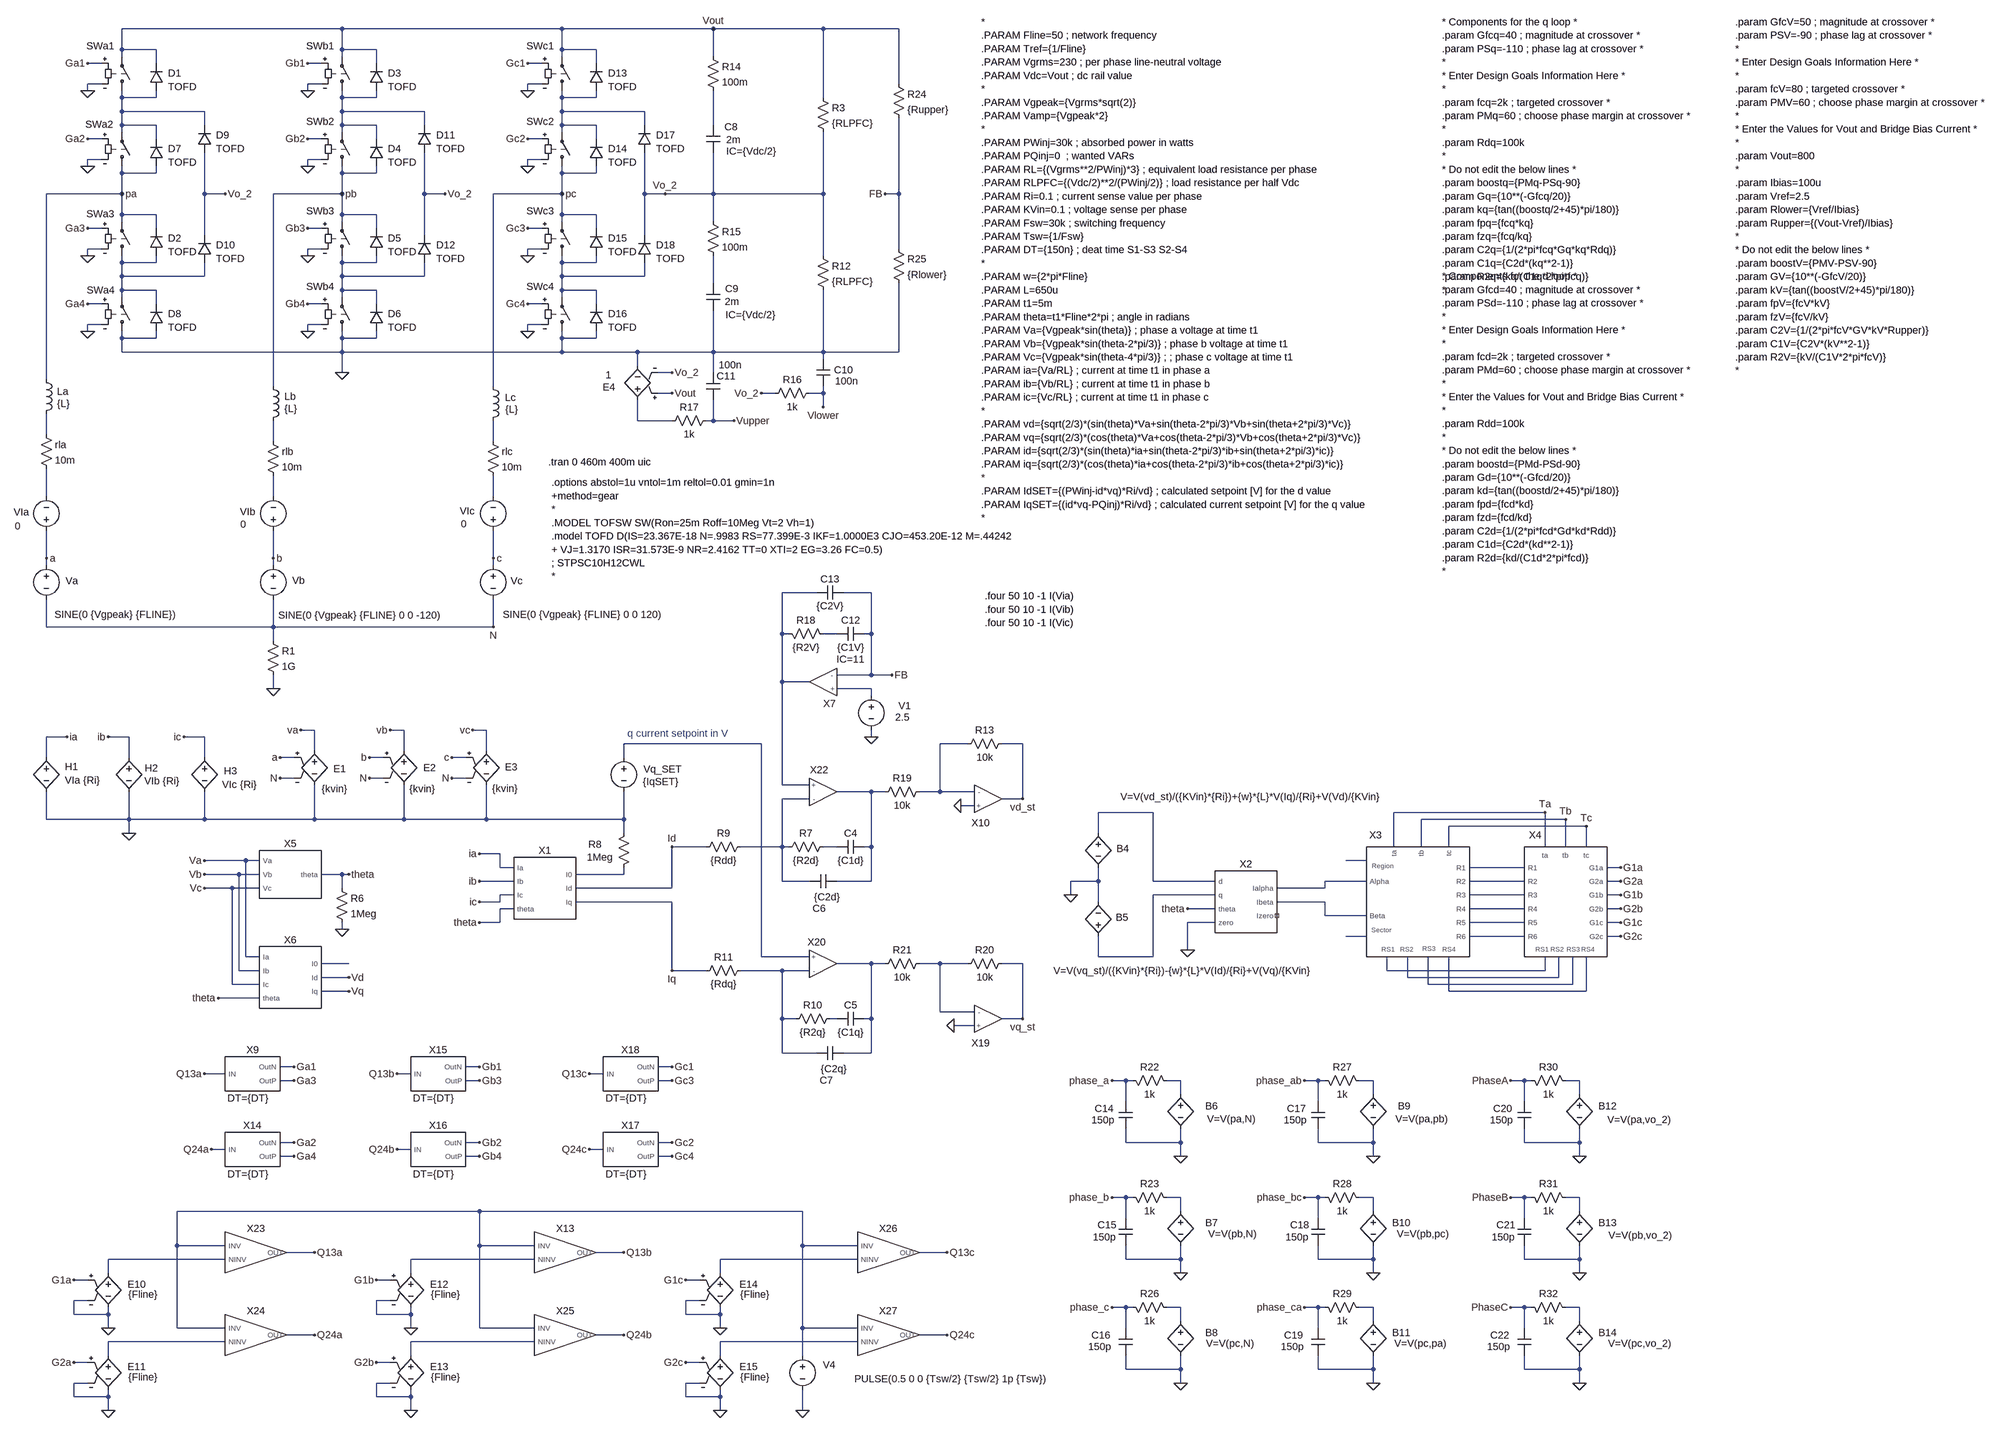
[diagram p0: schematic 3-phase NPC inverter with switches - PFC 800 V - SVM.asc]
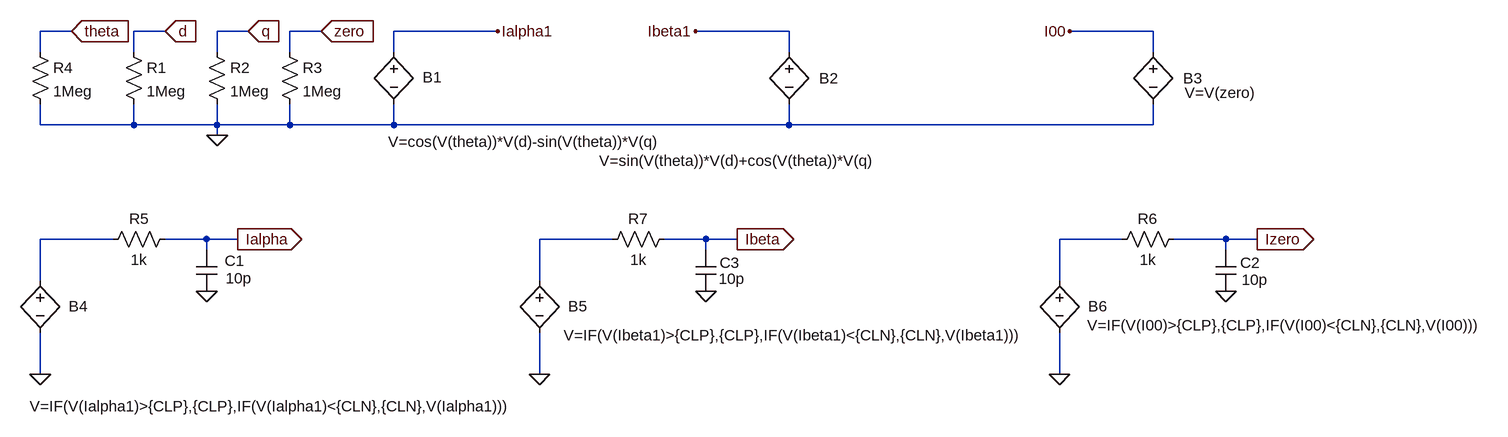
[diagram p1: sub-circuit inverse_dq_alpha_beta.asc]
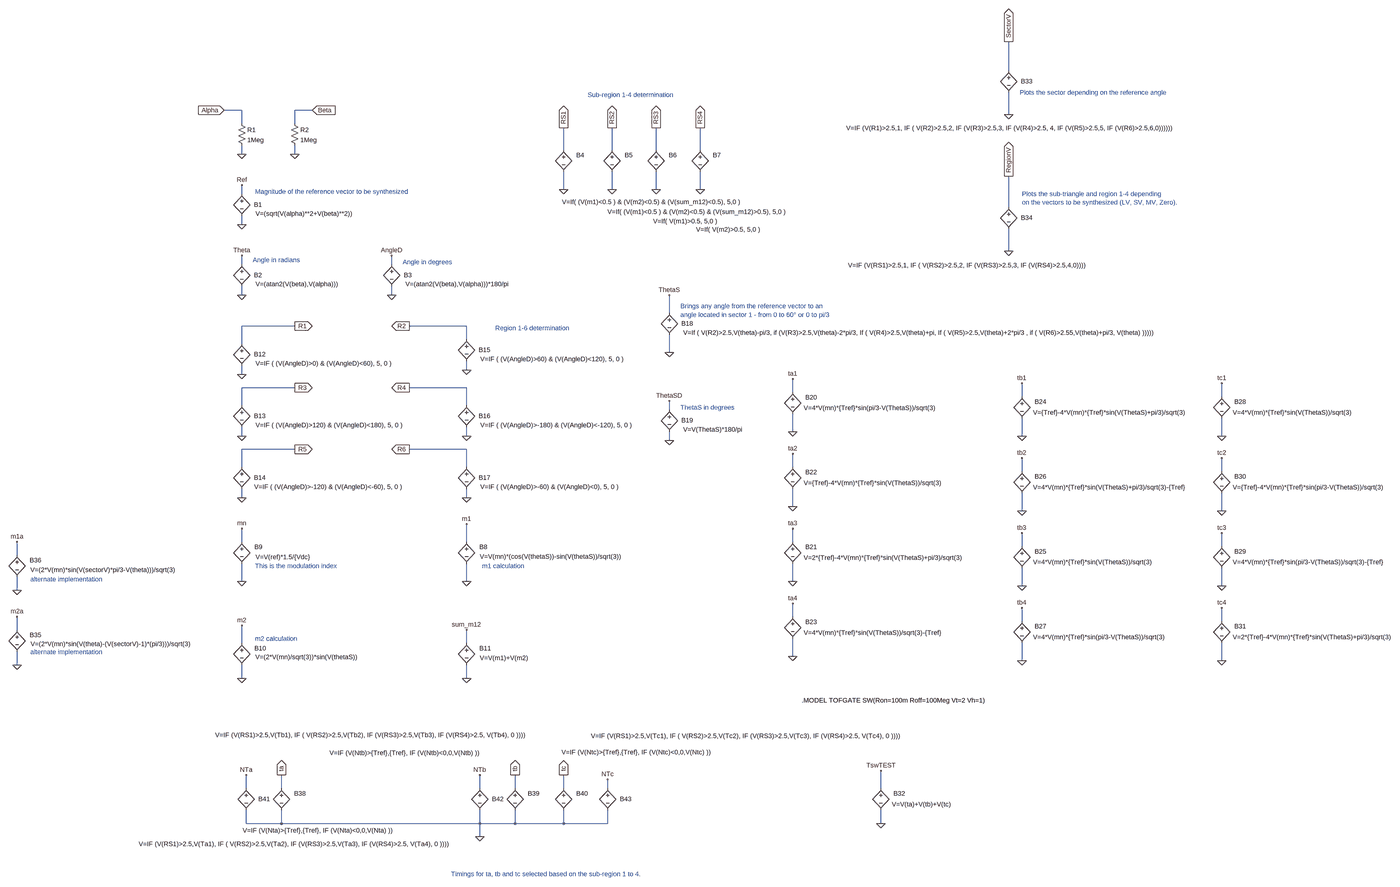
[diagram p2: sub-circuit alphabetatimings.asc, whole sheet]
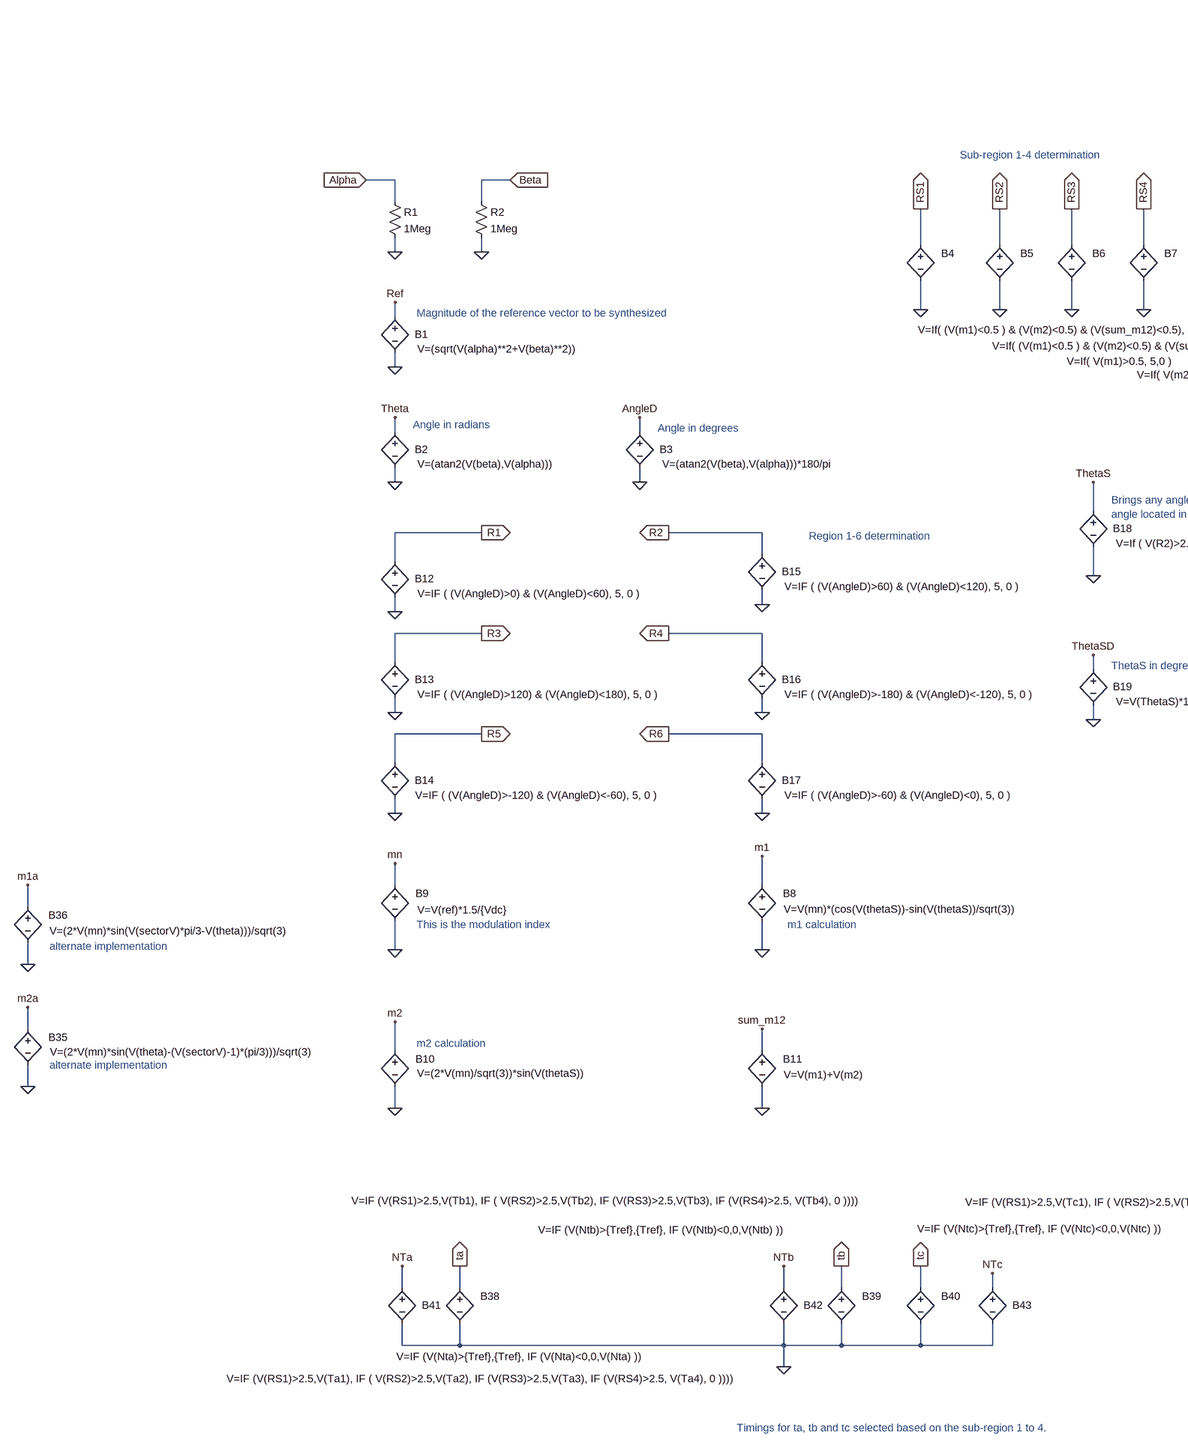
[diagram p3: sub-circuit alphabetatimings.asc, part, row 1 of 1, column 1 of 2]
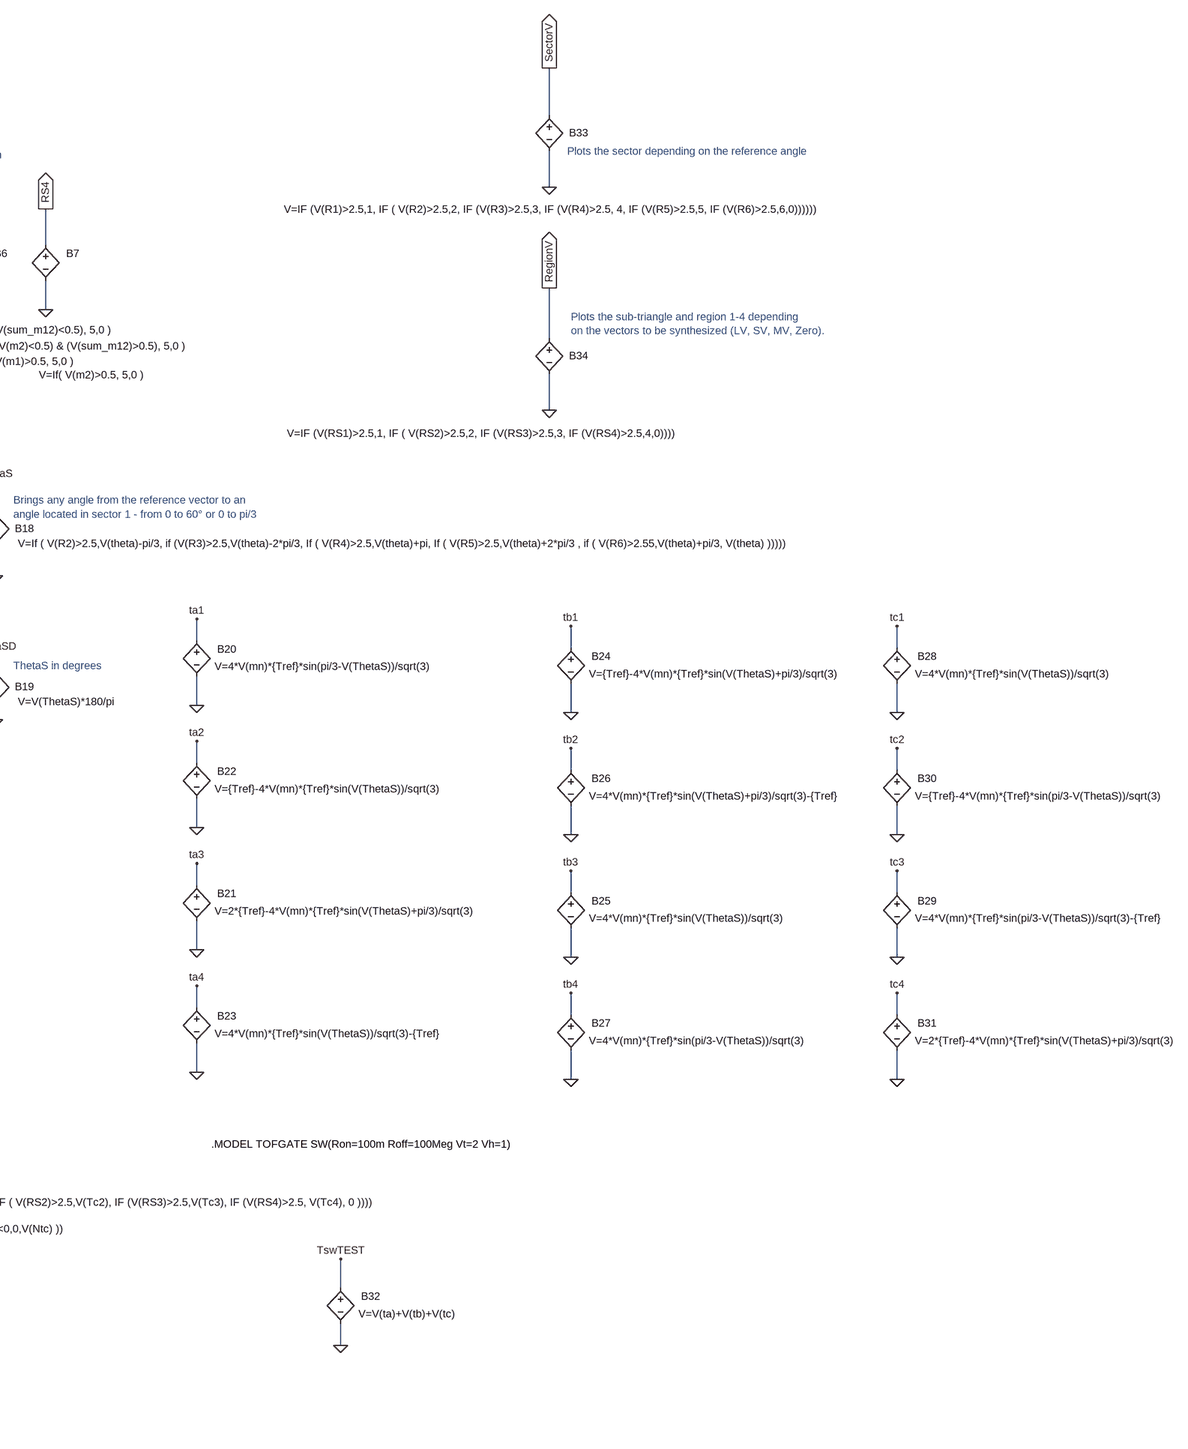
[diagram p4: sub-circuit alphabetatimings.asc, part, row 1 of 1, column 2 of 2]
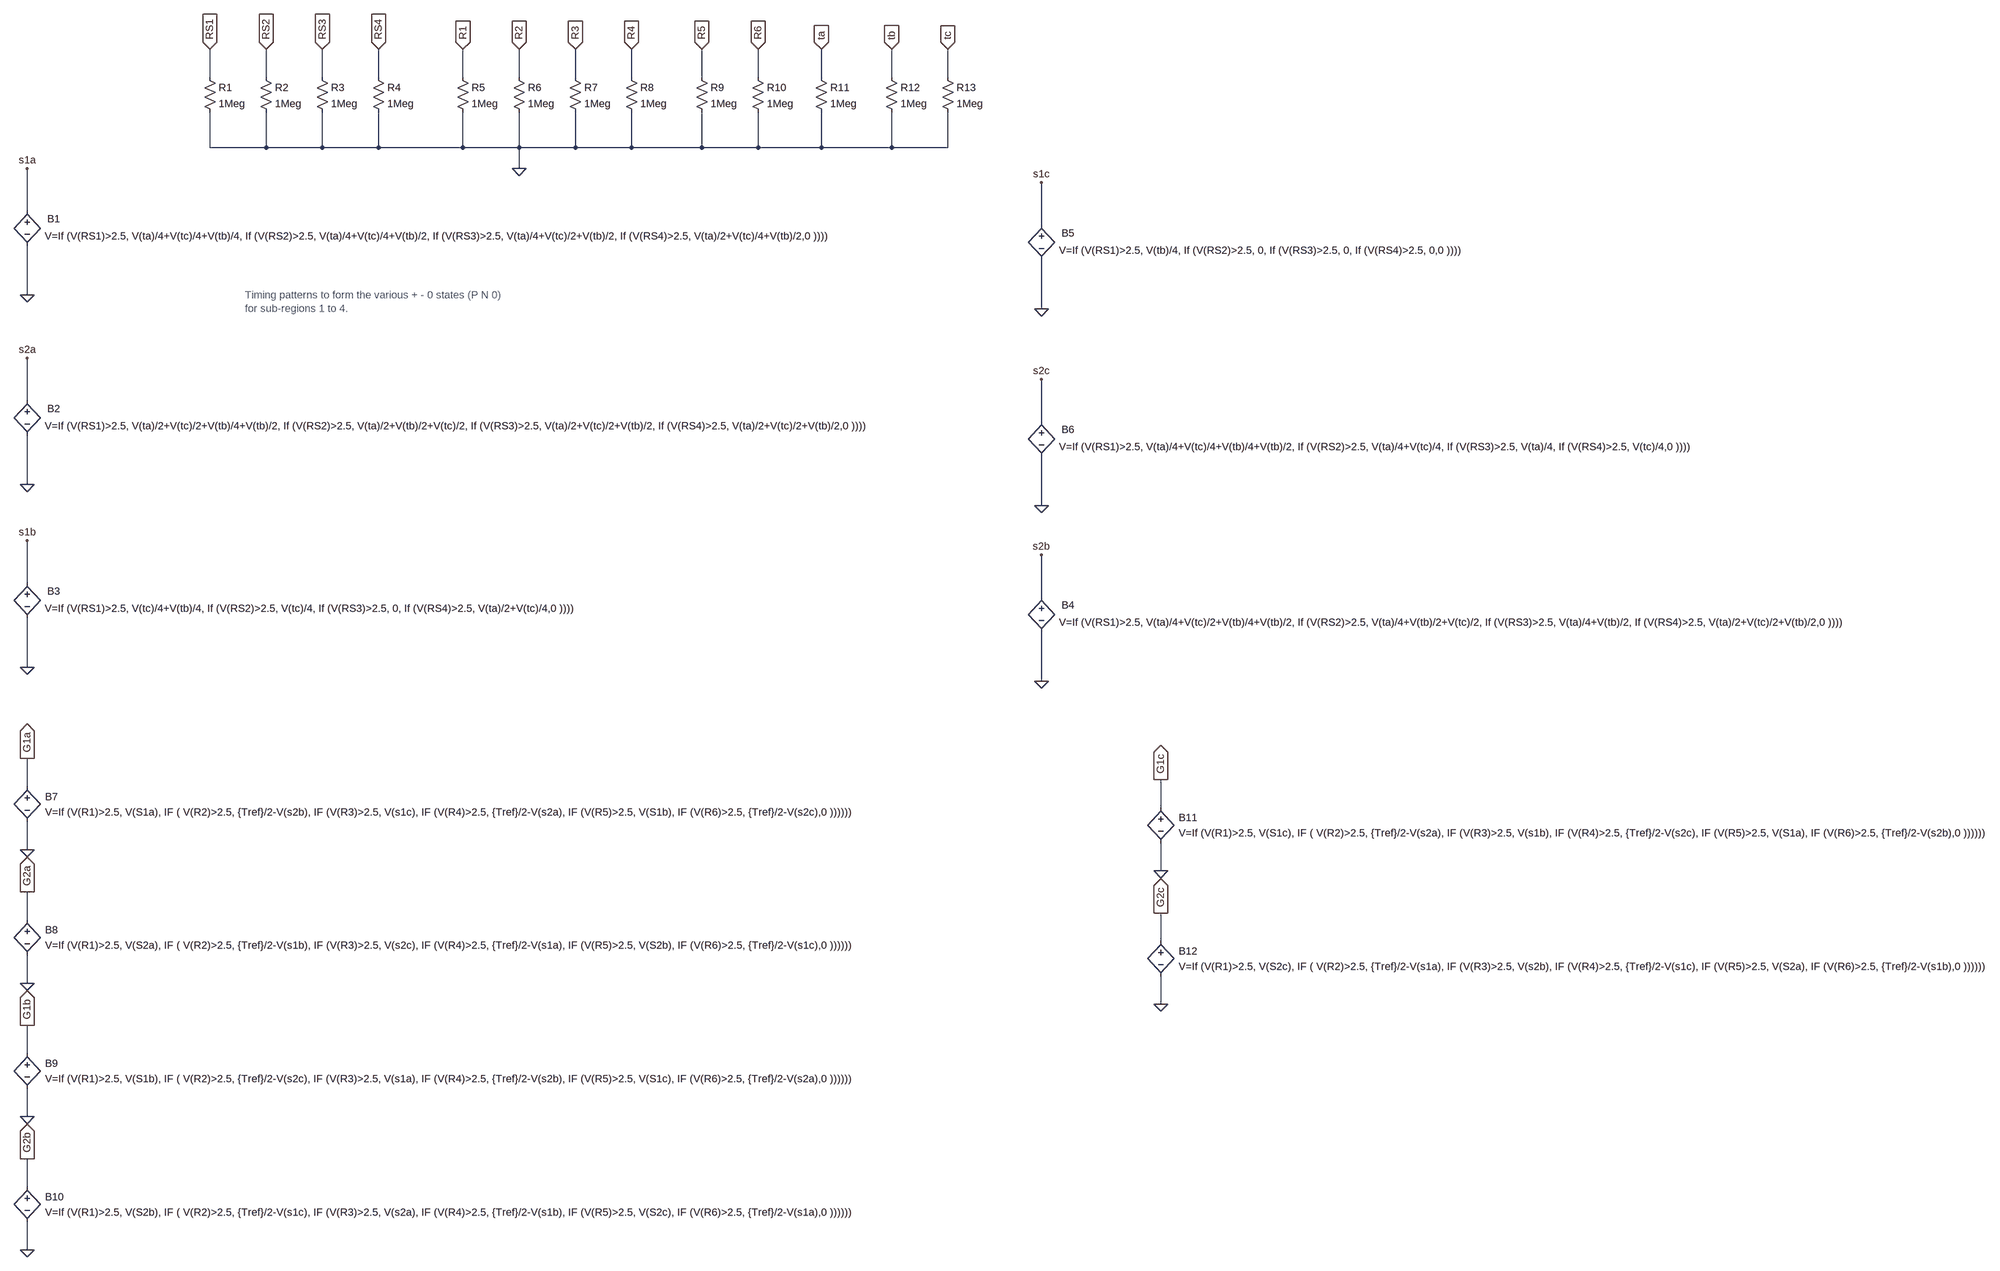
[diagram p5: sub-circuit timinggenerator.asc]
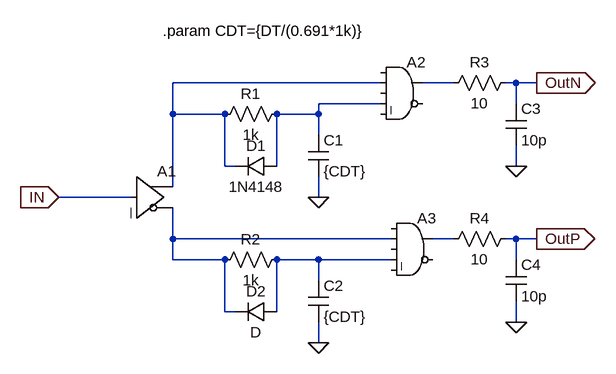
[diagram p6: sub-circuit dt_driver.asc]
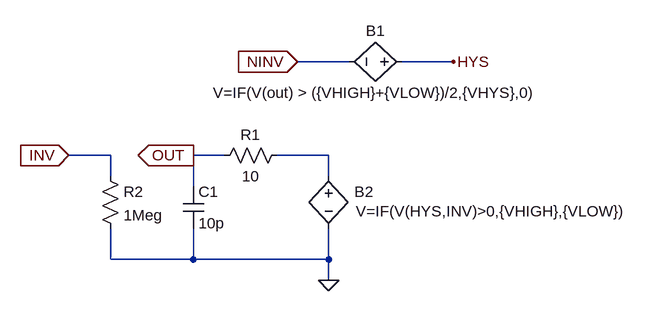
[diagram p7: sub-circuit comptof.asc]
* 3-phase NPC inverter with switches - PFC 800 V - SVM.asc
Va a N SINE(0 {Vgpeak} {FLINE})
Vb b N SINE(0 {Vgpeak} {FLINE} 0 0 -120)
Vc c N SINE(0 {Vgpeak} {FLINE} 0 0 120)
R1 N 0 1G
rla N010 N013 10m
rlb N011 N014 10m
rlc N012 N015 10m
H1 ia 0 VIa {Ri}
H2 ib 0 VIb {Ri}
H3 ic 0 VIc {Ri}
La pa N010 {L}
Lb pb N011 {L}
Lc pc N012 {L}
VIa a N013 0
VIb b N014 0
VIc c N015 0
SWa1 N001 Vout Ga1 0 TOFSW
E1 va 0 a N {kvin}
E2 vb 0 b N {kvin}
E3 vc 0 c N {kvin}
R7 N022 N024 {R2d}
C4 N024 N021 {C1d}
C6 N022 N021 {C2d}
R8 0 N027 1Meg
R9 N022 Id {Rdd}
R10 N040 N045 {R2q}
C5 N045 N038 {C1q}
C7 N040 N038 {C2q}
R11 N040 Iq {Rdq}
D1 N001 Vout TOFD
SWa2 pa N001 Ga2 0 TOFSW
D7 pa N001 TOFD
SWa3 N005 pa Ga3 0 TOFSW
D2 N005 pa TOFD
SWa4 0 N005 Ga4 0 TOFSW
D8 0 N005 TOFD
D9 Vo_2 N001 TOFD
D10 N005 Vo_2 TOFD
D3 N002 Vout TOFD
D4 pb N002 TOFD
D5 N006 pb TOFD
D6 0 N006 TOFD
D11 Vo_2 N002 TOFD
D12 N006 Vo_2 TOFD
D13 N003 Vout TOFD
D14 pc N003 TOFD
D15 N007 pc TOFD
D16 0 N007 TOFD
D17 Vo_2 N003 TOFD
D18 N007 Vo_2 TOFD
SWb1 N002 Vout Gb1 0 TOFSW
SWb2 pb N002 Gb2 0 TOFSW
SWb3 N006 pb Gb3 0 TOFSW
SWb4 0 N006 Gb4 0 TOFSW
SWc1 N003 Vout Gc1 0 TOFSW
SWc2 pc N003 Gc2 0 TOFSW
SWc3 N007 pc Gc3 0 TOFSW
SWc4 0 N007 Gc4 0 TOFSW
R13 vd_st N020 10k
R19 N020 N021 10k
R20 vq_st N039 10k
R21 N039 N038 10k
Vq_SET N019 0 {IqSET}
X§X2 N023 N030 theta 0 N028 N032 NC_01 inverse_dq_alpha_beta params: CLP=1500 CLN=-1500
X§X3 N028 N032 N026 N029 N031 N033 N034 N036 N025 N041 N042 N043 N044 N035 Ta Tb Tc alphabetatimings params: Tsw={Tsw} k1=1
X§X4 N026 N029 N031 N033 N034 N036 N041 N042 N043 N044 G1a G1b G1c G2a G2b G2c Ta Tb Tc timinggenerator params: Tsw={Tsw}
X§X1 ia ib ic theta N027 Id Iq dq0_sub  ; pins Ia Ib Ic theta I0 Id Iq
X§X22 N022 N016 N021 opampTOF params: VHIGH=5 VLOW=-5  ; pins - + OUT
X§X10 N020 0 vd_st opampTOF params: VHIGH=5 VLOW=-5  ; pins - + OUT
X§X19 N039 0 vq_st opampTOF params: VHIGH=5 VLOW=-5  ; pins - + OUT
X§X20 N040 N019 N038 opampTOF params: VHIGH=5 VLOW=-5  ; pins - + OUT
X§X9 Q13a Ga1 Ga3 dt_driver params: DT={DT}
X§X14 Q24a Ga2 Ga4 dt_driver params: DT={DT}
X§X15 Q13b Gb1 Gb3 dt_driver params: DT={DT}
X§X16 Q24b Gb2 Gb4 dt_driver params: DT={DT}
X§X17 Q24c Gc2 Gc4 dt_driver params: DT={DT}
X§X18 Q13c Gc1 Gc3 dt_driver params: DT={DT}
V4 N052 0 PULSE(0.5 0 0 {Tsw/2} {Tsw/2} 1p {Tsw})
E10 N053 0 G1a 0 {Fline}
E11 N059 0 G2a 0 {Fline}
E12 N054 0 G1b 0 {Fline}
E13 N060 0 G2b 0 {Fline}
E14 N055 0 G1c 0 {Fline}
E15 N061 0 G2c 0 {Fline}
X§X13 N052 N054 Q13b comptof params: VHIGH=5 VLOW=100m VHYS=10m
X§X23 N052 N053 Q13a comptof params: VHIGH=5 VLOW=100m VHYS=10m
X§X24 N052 N059 Q24a comptof params: VHIGH=5 VLOW=100m VHYS=10m
X§X25 N052 N060 Q24b comptof params: VHIGH=5 VLOW=100m VHYS=10m
X§X26 N052 N055 Q13c comptof params: VHIGH=5 VLOW=100m VHYS=10m
X§X27 N052 N061 Q24c comptof params: VHIGH=5 VLOW=100m VHYS=10m
B4 N023 0 V=V(vd_st)/({KVin}*{Ri})+{w}*{L}*V(Iq)/{Ri}+V(Vd)/{KVin}
B5 N030 0 V=V(vq_st)/({KVin}*{Ri})-{w}*{L}*V(Id)/{Ri}+V(Vq)/{KVin}
R6 theta 0 1Meg
X§X5 va vb vc theta theta_sub  ; pins Va Vb Vc theta
X§X6 va vb vc theta N037 Vd Vq dq0_sub  ; pins Ia Ib Ic theta I0 Id Iq
C8 N004 Vo_2 2m IC={Vdc/2}
C9 N008 0 2m IC={Vdc/2}
R3 Vout Vo_2 {RLPFC}
R12 Vo_2 0 {RLPFC}
R14 Vout N004 100m
R15 Vo_2 N008 100m
R16 Vlower Vo_2 1k
C10 0 Vlower 100n
R17 Vupper N009 1k
C11 0 Vupper 100n
E4 N009 0 Vout Vo_2 1
R18 N016 N017 {R2V}
C12 N017 FB {C1V} IC=11
C13 N016 FB {C2V}
V1 N018 0 2.5
X§X7 FB N018 N016 opampTOF params: VHIGH=25 VLOW=100m  ; pins - + OUT
R24 Vout FB {Rupper}
R25 FB 0 {Rlower}
R22 phase_a N046 1k
C14 phase_a 0 150p
B6 N046 0 V=V(pa,N)
R23 phase_b N049 1k
C15 phase_b 0 150p
B7 N049 0 V=V(pb,N)
R26 phase_c N056 1k
C16 phase_c 0 150p
B8 N056 0 V=V(pc,N)
R27 phase_ab N047 1k
C17 phase_ab 0 150p
B9 N047 0 V=V(pa,pb)
R28 phase_bc N050 1k
C18 phase_bc 0 150p
B10 N050 0 V=V(pb,pc)
R29 phase_ca N057 1k
C19 phase_ca 0 150p
B11 N057 0 V=V(pc,pa)
R30 PhaseA N048 1k
C20 PhaseA 0 150p
B12 N048 0 V=V(pa,vo_2)
R31 PhaseB N051 1k
C21 PhaseB 0 150p
B13 N051 0 V=V(pb,vo_2)
R32 PhaseC N058 1k
C22 PhaseC 0 150p
B14 N058 0 V=V(pc,vo_2)

* block symbol definitions
.subckt inverse_dq_alpha_beta d q theta zero Ialpha Ibeta Izero
R1 d 0 1Meg
R2 q 0 1Meg
R3 zero 0 1Meg
B1 Ialpha1 0 V=cos(V(theta))*V(d)-sin(V(theta))*V(q)
B2 Ibeta1 0 V=sin(V(theta))*V(d)+cos(V(theta))*V(q)
R4 theta 0 1Meg
B3 I00 0 V=V(zero)
B4 N001 0 V=IF(V(Ialpha1)>{CLP},{CLP},IF(V(Ialpha1)<{CLN},{CLN},V(Ialpha1)))
B5 N002 0 V=IF(V(Ibeta1)>{CLP},{CLP},IF(V(Ibeta1)<{CLN},{CLN},V(Ibeta1)))
B6 N003 0 V=IF(V(I00)>{CLP},{CLP},IF(V(I00)<{CLN},{CLN},V(I00)))
R5 Ialpha N001 1k
R6 Izero N003 1k
R7 Ibeta N002 1k
C1 Ialpha 0 10p
C2 Izero 0 10p
C3 Ibeta 0 10p
.ends inverse_dq_alpha_beta

.subckt alphabetatimings Alpha Beta R1 R2 R3 R4 R5 R6 RegionV RS1 RS2 RS3 RS4 SectorV ta tb tc
B1 Ref 0 V=(sqrt(V(alpha)**2+V(beta)**2))
B2 Theta 0 V=(atan2(V(beta),V(alpha)))
B3 AngleD 0 V=(atan2(V(beta),V(alpha)))*180/pi
R1 Alpha 0 1Meg
R2 Beta 0 1Meg
B4 RS1 0 V=If( (V(m1)<0.5 ) & (V(m2)<0.5) & (V(sum_m12)<0.5), 5,0 )
B5 RS2 0 V=If( (V(m1)<0.5 ) & (V(m2)<0.5) & (V(sum_m12)>0.5), 5,0 )
B6 RS3 0 V=If( V(m1)>0.5, 5,0 )
B7 RS4 0 V=If( V(m2)>0.5, 5,0 )
B8 m1 0 V=V(mn)*(cos(V(thetaS))-sin(V(thetaS))/sqrt(3))
B9 mn 0 V=V(ref)*1.5/{Vdc}
B10 m2 0 V=(2*V(mn)/sqrt(3))*sin(V(thetaS))
B11 sum_m12 0 V=V(m1)+V(m2)
B12 R1 0 V=IF ( (V(AngleD)>0) & (V(AngleD)<60), 5, 0 )
B13 R3 0 V=IF ( (V(AngleD)>120) & (V(AngleD)<180), 5, 0 )
B14 R5 0 V=IF ( (V(AngleD)>-120) & (V(AngleD)<-60), 5, 0 )
B15 R2 0 V=IF ( (V(AngleD)>60) & (V(AngleD)<120), 5, 0 )
B16 R4 0 V=IF ( (V(AngleD)>-180) & (V(AngleD)<-120), 5, 0 )
B17 R6 0 V=IF ( (V(AngleD)>-60) & (V(AngleD)<0), 5, 0 )
B18 ThetaS 0 V=If ( V(R2)>2.5,V(theta)-pi/3, if (V(R3)>2.5,V(theta)-2*pi/3, If ( V(R4)>2.5,V(theta)+pi, If ( V(R5)>2.5,V(theta)+2*pi/3 , if ( V(R6)>2.55,V(theta)+pi/3, V(theta) )))))
B19 ThetaSD 0 V=V(ThetaS)*180/pi
B20 ta1 0 V=4*V(mn)*{Tref}*sin(pi/3-V(ThetaS))/sqrt(3)
B21 ta3 0 V=2*{Tref}-4*V(mn)*{Tref}*sin(V(ThetaS)+pi/3)/sqrt(3)
B22 ta2 0 V={Tref}-4*V(mn)*{Tref}*sin(V(ThetaS))/sqrt(3)
B23 ta4 0 V=4*V(mn)*{Tref}*sin(V(ThetaS))/sqrt(3)-{Tref}
B24 tb1 0 V={Tref}-4*V(mn)*{Tref}*sin(V(ThetaS)+pi/3)/sqrt(3)
B25 tb3 0 V=4*V(mn)*{Tref}*sin(V(ThetaS))/sqrt(3)
B26 tb2 0 V=4*V(mn)*{Tref}*sin(V(ThetaS)+pi/3)/sqrt(3)-{Tref}
B27 tb4 0 V=4*V(mn)*{Tref}*sin(pi/3-V(ThetaS))/sqrt(3)
B28 tc1 0 V=4*V(mn)*{Tref}*sin(V(ThetaS))/sqrt(3)
B29 tc3 0 V=4*V(mn)*{Tref}*sin(pi/3-V(ThetaS))/sqrt(3)-{Tref}
B30 tc2 0 V={Tref}-4*V(mn)*{Tref}*sin(pi/3-V(ThetaS))/sqrt(3)
B31 tc4 0 V=2*{Tref}-4*V(mn)*{Tref}*sin(V(ThetaS)+pi/3)/sqrt(3)
B32 TswTEST 0 V=V(ta)+V(tb)+V(tc)
B33 SectorV 0 V=IF (V(R1)>2.5,1, IF ( V(R2)>2.5,2, IF (V(R3)>2.5,3, IF (V(R4)>2.5, 4, IF (V(R5)>2.5,5, IF (V(R6)>2.5,6,0))))))
B34 RegionV 0 V=IF (V(RS1)>2.5,1, IF ( V(RS2)>2.5,2, IF (V(RS3)>2.5,3, IF (V(RS4)>2.5,4,0))))
B38 ta 0 V=IF (V(Nta)>{Tref},{Tref}, IF (V(Nta)<0,0,V(Nta) ))
B39 tb 0 V=IF (V(Ntb)>{Tref},{Tref}, IF (V(Ntb)<0,0,V(Ntb) ))
B40 tc 0 V=IF (V(Ntc)>{Tref},{Tref}, IF (V(Ntc)<0,0,V(Ntc) ))
B41 NTa 0 V=IF (V(RS1)>2.5,V(Ta1), IF ( V(RS2)>2.5,V(Ta2), IF (V(RS3)>2.5,V(Ta3), IF (V(RS4)>2.5, V(Ta4), 0 ))))
B42 NTb 0 V=IF (V(RS1)>2.5,V(Tb1), IF ( V(RS2)>2.5,V(Tb2), IF (V(RS3)>2.5,V(Tb3), IF (V(RS4)>2.5, V(Tb4), 0 ))))
B43 NTc 0 V=IF (V(RS1)>2.5,V(Tc1), IF ( V(RS2)>2.5,V(Tc2), IF (V(RS3)>2.5,V(Tc3), IF (V(RS4)>2.5, V(Tc4), 0 ))))
B35 m2a 0 V=(2*V(mn)*sin(V(theta)-(V(sectorV)-1)*(pi/3)))/sqrt(3)
B36 m1a 0 V=(2*V(mn)*sin(V(sectorV)*pi/3-V(theta)))/sqrt(3)
* Angle in radians
* Magnitude of the reference vector to be synthesized
* Angle in degrees
* Sub-region 1-4 determination
* m1 calculation
* m2 calculation
* Region 1-6 determination
* This is the modulation index
* Brings any angle from the reference vector to an
* angle located in sector 1 - from 0 to 60° or 0 to pi/3
* ThetaS in degrees
* Timings for ta, tb and tc selected based on the sub-region 1 to 4.
* Plots the sector depending on the reference angle
* Plots the sub-triangle and region 1-4 depending
* on the vectors to be synthesized (LV, SV, MV, Zero).
.MODEL TOFGATE SW(Ron=100m Roff=100Meg Vt=2 Vh=1)
* alternate implementation
* alternate implementation
.ends alphabetatimings

.subckt timinggenerator R1 R2 R3 R4 R5 R6 RS1 RS2 RS3 RS4 G1a G1b G1c G2a G2b G2c ta tb tc
B1 s1a 0 V=If (V(RS1)>2.5, V(ta)/4+V(tc)/4+V(tb)/4, If (V(RS2)>2.5, V(ta)/4+V(tc)/4+V(tb)/2, If (V(RS3)>2.5, V(ta)/4+V(tc)/2+V(tb)/2, If (V(RS4)>2.5, V(ta)/2+V(tc)/4+V(tb)/2,0 ))))
B2 s2a 0 V=If (V(RS1)>2.5, V(ta)/2+V(tc)/2+V(tb)/4+V(tb)/2, If (V(RS2)>2.5, V(ta)/2+V(tb)/2+V(tc)/2, If (V(RS3)>2.5, V(ta)/2+V(tc)/2+V(tb)/2, If (V(RS4)>2.5, V(ta)/2+V(tc)/2+V(tb)/2,0 ))))
B3 s1b 0 V=If (V(RS1)>2.5, V(tc)/4+V(tb)/4, If (V(RS2)>2.5, V(tc)/4, If (V(RS3)>2.5, 0, If (V(RS4)>2.5, V(ta)/2+V(tc)/4,0 ))))
B4 s2b 0 V=If (V(RS1)>2.5, V(ta)/4+V(tc)/2+V(tb)/4+V(tb)/2, If (V(RS2)>2.5, V(ta)/4+V(tb)/2+V(tc)/2, If (V(RS3)>2.5, V(ta)/4+V(tb)/2, If (V(RS4)>2.5, V(ta)/2+V(tc)/2+V(tb)/2,0 ))))
B5 s1c 0 V=If (V(RS1)>2.5, V(tb)/4, If (V(RS2)>2.5, 0, If (V(RS3)>2.5, 0, If (V(RS4)>2.5, 0,0 ))))
B6 s2c 0 V=If (V(RS1)>2.5, V(ta)/4+V(tc)/4+V(tb)/4+V(tb)/2, If (V(RS2)>2.5, V(ta)/4+V(tc)/4, If (V(RS3)>2.5, V(ta)/4, If (V(RS4)>2.5, V(tc)/4,0 ))))
B7 G1a 0 V=If (V(R1)>2.5, V(S1a), IF ( V(R2)>2.5, {Tref}/2-V(s2b), IF (V(R3)>2.5, V(s1c), IF (V(R4)>2.5, {Tref}/2-V(s2a), IF (V(R5)>2.5, V(S1b), IF (V(R6)>2.5, {Tref}/2-V(s2c),0 ))))))
B8 G2a 0 V=If (V(R1)>2.5, V(S2a), IF ( V(R2)>2.5, {Tref}/2-V(s1b), IF (V(R3)>2.5, V(s2c), IF (V(R4)>2.5, {Tref}/2-V(s1a), IF (V(R5)>2.5, V(S2b), IF (V(R6)>2.5, {Tref}/2-V(s1c),0 ))))))
B9 G1b 0 V=If (V(R1)>2.5, V(S1b), IF ( V(R2)>2.5, {Tref}/2-V(s2c), IF (V(R3)>2.5, V(s1a), IF (V(R4)>2.5, {Tref}/2-V(s2b), IF (V(R5)>2.5, V(S1c), IF (V(R6)>2.5, {Tref}/2-V(s2a),0 ))))))
B10 G2b 0 V=If (V(R1)>2.5, V(S2b), IF ( V(R2)>2.5, {Tref}/2-V(s1c), IF (V(R3)>2.5, V(s2a), IF (V(R4)>2.5, {Tref}/2-V(s1b), IF (V(R5)>2.5, V(S2c), IF (V(R6)>2.5, {Tref}/2-V(s1a),0 ))))))
B11 G1c 0 V=If (V(R1)>2.5, V(S1c), IF ( V(R2)>2.5, {Tref}/2-V(s2a), IF (V(R3)>2.5, V(s1b), IF (V(R4)>2.5, {Tref}/2-V(s2c), IF (V(R5)>2.5, V(S1a), IF (V(R6)>2.5, {Tref}/2-V(s2b),0 ))))))
B12 G2c 0 V=If (V(R1)>2.5, V(S2c), IF ( V(R2)>2.5, {Tref}/2-V(s1a), IF (V(R3)>2.5, V(s2b), IF (V(R4)>2.5, {Tref}/2-V(s1c), IF (V(R5)>2.5, V(S2a), IF (V(R6)>2.5, {Tref}/2-V(s1b),0 ))))))
R1 RS1 0 1Meg
R2 RS2 0 1Meg
R3 RS3 0 1Meg
R4 RS4 0 1Meg
R5 R1 0 1Meg
R6 R2 0 1Meg
R7 R3 0 1Meg
R8 R4 0 1Meg
R9 R5 0 1Meg
R10 R6 0 1Meg
R11 ta 0 1Meg
R12 tb 0 1Meg
R13 tc 0 1Meg
* Timing patterns to form the various + - 0 states (P N 0)
* for sub-regions 1 to 4.
.ends timinggenerator

.subckt dt_driver IN OutN OutP
A1 IN 0 0 0 0 N004 N001 0 BUF Vhigh=5 Vlow=0 Ref=1.0
R1 N003 N001 1k
C1 N003 0 {CDT}
R2 N006 N004 1k
C2 N006 0 {CDT}
A2 0 N001 0 N003 0 0 N002 0 AND Vhigh=5 Vlow=0 Ref=2.5
A3 0 N004 0 N006 0 0 N005 0 AND Vhigh=5 Vlow=0 Ref=2.5
D1 N003 N001 1N4148
D2 N006 N004 D
R3 OutN N002 10
R4 OutP N005 10
C3 OutN 0 10p
C4 OutP 0 10p
.param CDT={DT/(0.691*1k)}
.ends dt_driver

.subckt comptof INV NINV OUT
B1 HYS NINV V=IF(V(out) > ({VHIGH}+{VLOW})/2,{VHYS},0)
B2 N001 0 V=IF(V(HYS,INV)>0,{VHIGH},{VLOW})
R1 N001 OUT 10
C1 OUT 0 10p
R2 INV 0 1Meg
.ends comptof

.model D D
.lib standard.dio
.tran 0 460m 400m uic
* Components for the d loop *
.param Gfcd=40 ; magnitude at crossover *
.param PSd=-110 ; phase lag at crossover *
*
* Enter Design Goals Information Here *
*
.param fcd=2k ; targeted crossover *
.param PMd=60 ; choose phase margin at crossover *
*
* Enter the Values for Vout and Bridge Bias Current *
*
.param Rdd=100k
*
* Do not edit the below lines *
.param boostd={PMd-PSd-90}
.param Gd={10**(-Gfcd/20)}
.param kd={tan((boostd/2+45)*pi/180)}
.param fpd={fcd*kd}
.param fzd={fcd/kd}
.param C2d={1/(2*pi*fcd*Gd*kd*Rdd)}
.param C1d={C2d*(kd**2-1)}
.param R2d={kd/(C1d*2*pi*fcd)}
*
* Components for the q loop *
.param Gfcq=40 ; magnitude at crossover *
.param PSq=-110 ; phase lag at crossover *
*
* Enter Design Goals Information Here *
*
.param fcq=2k ; targeted crossover *
.param PMq=60 ; choose phase margin at crossover *
*
.param Rdq=100k
*
* Do not edit the below lines *
.param boostq={PMq-PSq-90}
.param Gq={10**(-Gfcq/20)}
.param kq={tan((boostq/2+45)*pi/180)}
.param fpq={fcq*kq}
.param fzq={fcq/kq}
.param C2q={1/(2*pi*fcq*Gq*kq*Rdq)}
.param C1q={C2d*(kq**2-1)}
.param R2q={kq/(C1q*2*pi*fcq)}
*
.four 50 10 -1 I(Via)
.four 50 10 -1 I(Vib)
.four 50 10 -1 I(Vic)
.options abstol=1u vntol=1m reltol=0.01 gmin=1n
+method=gear
*
.MODEL TOFSW SW(Ron=25m Roff=10Meg Vt=2 Vh=1)
.model TOFD D(IS=23.367E-18 N=.9983 RS=77.399E-3 IKF=1.0000E3 CJO=453.20E-12 M=.44242
+ VJ=1.3170 ISR=31.573E-9 NR=2.4162 TT=0 XTI=2 EG=3.26 FC=0.5)
; STPSC10H12CWL
*
*
.PARAM Fline=50 ; network frequency
.PARAM Tref={1/Fline}
.PARAM Vgrms=230 ; per phase line-neutral voltage
.PARAM Vdc=Vout ; dc rail value
*
.PARAM Vgpeak={Vgrms*sqrt(2)}
.PARAM Vamp={Vgpeak*2}
*
.PARAM PWinj=30k ; absorbed power in watts
.PARAM PQinj=0  ; wanted VARs
.PARAM RL={(Vgrms**2/PWinj)*3} ; equivalent load resistance per phase
.PARAM RLPFC={(Vdc/2)**2/(PWinj/2)} ; load resistance per half Vdc
.PARAM Ri=0.1 ; current sense value per phase
.PARAM KVin=0.1 ; voltage sense per phase
.PARAM Fsw=30k ; switching frequency
.PARAM Tsw={1/Fsw}
.PARAM DT={150n} ; deat time S1-S3 S2-S4
*
.PARAM w={2*pi*Fline}
.PARAM L=650u
.PARAM t1=5m
.PARAM theta=t1*Fline*2*pi ; angle in radians
.PARAM Va={Vgpeak*sin(theta)} ; phase a voltage at time t1
.PARAM Vb={Vgpeak*sin(theta-2*pi/3)} ; phase b voltage at time t1
.PARAM Vc={Vgpeak*sin(theta-4*pi/3)} ; ; phase c voltage at time t1
.PARAM ia={Va/RL} ; current at time t1 in phase a
.PARAM ib={Vb/RL} ; current at time t1 in phase b
.PARAM ic={Vc/RL} ; current at time t1 in phase c
*
.PARAM vd={sqrt(2/3)*(sin(theta)*Va+sin(theta-2*pi/3)*Vb+sin(theta+2*pi/3)*Vc)}
.PARAM vq={sqrt(2/3)*(cos(theta)*Va+cos(theta-2*pi/3)*Vb+cos(theta+2*pi/3)*Vc)}
.PARAM id={sqrt(2/3)*(sin(theta)*ia+sin(theta-2*pi/3)*ib+sin(theta+2*pi/3)*ic)}
.PARAM iq={sqrt(2/3)*(cos(theta)*ia+cos(theta-2*pi/3)*ib+cos(theta+2*pi/3)*ic)}
*
.PARAM IdSET={(PWinj-id*vq)*Ri/vd} ; calculated setpoint [V] for the d value
.PARAM IqSET={(id*vq-PQinj)*Ri/vd} ; calculated current setpoint [V] for the q value
*
* q current setpoint in V
.param GfcV=50 ; magnitude at crossover *
.param PSV=-90 ; phase lag at crossover *
*
* Enter Design Goals Information Here *
*
.param fcV=80 ; targeted crossover *
.param PMV=60 ; choose phase margin at crossover *
*
* Enter the Values for Vout and Bridge Bias Current *
*
.param Vout=800
*
.param Ibias=100u
.param Vref=2.5
.param Rlower={Vref/Ibias}
.param Rupper={(Vout-Vref)/Ibias}
*
* Do not edit the below lines *
.param boostV={PMV-PSV-90}
.param GV={10**(-GfcV/20)}
.param kV={tan((boostV/2+45)*pi/180)}
.param fpV={fcV*kV}
.param fzV={fcV/kV}
.param C2V={1/(2*pi*fcV*GV*kV*Rupper)}
.param C1V={C2V*(kV**2-1)}
.param R2V={kV/(C1V*2*pi*fcV)}
*
.backanno
.end